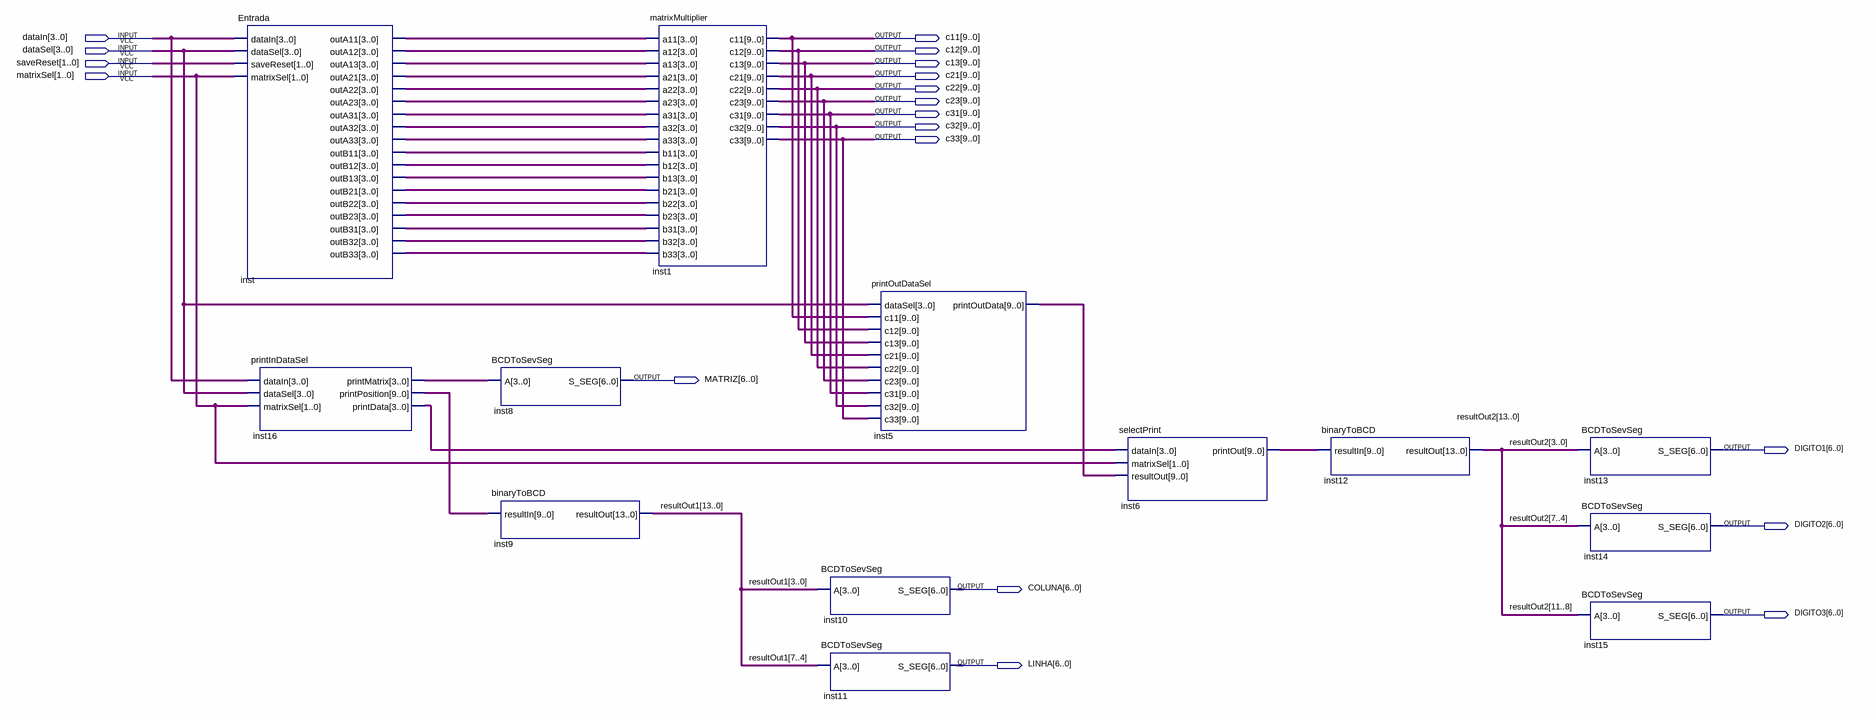
[diagram p0: schematic sheet]
// Quartus schematic Matrix_Multiplier.bdf as structural Verilog: 13 symbols, 19 pins
module Matrix_Multiplier (
  input  [3:0] dataIn,
  input  [3:0] dataSel,
  input  [1:0] saveReset,
  input  [1:0] matrixSel,
  output [9:0] c11,
  output [9:0] c12,
  output [9:0] c13,
  output [9:0] c21,
  output [9:0] c22,
  output [9:0] c23,
  output [9:0] c31,
  output [9:0] c32,
  output [9:0] c33,
  output [6:0] MATRIZ,
  output [6:0] DIGITO1,
  output [6:0] DIGITO2,
  output [6:0] COLUNA,
  output [6:0] DIGITO3,
  output [6:0] LINHA
);

  wire [3:0] inst16_printdata, inst16_printmatrix, inst_outa11, inst_outa12, inst_outa13, inst_outa21,
       inst_outa22, inst_outa23, inst_outa31, inst_outa32, inst_outa33, inst_outb11, inst_outb12,
       inst_outb13, inst_outb21, inst_outb22, inst_outb23, inst_outb31, inst_outb32, inst_outb33;
  wire [9:0] inst5_printoutdata, inst6_printout, inst16_printposition;
  wire [13:0] resultOut1, resultOut2;

  Entrada inst (
    .dataIn(dataIn), .dataSel(dataSel), .saveReset(saveReset), .matrixSel(matrixSel), .outA11(inst_outa11),
    .outA12(inst_outa12), .outA13(inst_outa13), .outA21(inst_outa21), .outA22(inst_outa22),
    .outA23(inst_outa23), .outA31(inst_outa31), .outA32(inst_outa32), .outA33(inst_outa33),
    .outB11(inst_outb11), .outB12(inst_outb12), .outB13(inst_outb13), .outB21(inst_outb21),
    .outB22(inst_outb22), .outB23(inst_outb23), .outB31(inst_outb31), .outB32(inst_outb32),
    .outB33(inst_outb33));
  printInDataSel inst16 (
    .dataIn(dataIn), .dataSel(dataSel), .matrixSel(matrixSel), .printMatrix(inst16_printmatrix),
    .printPosition(inst16_printposition), .printData(inst16_printdata));
  BCDToSevSeg inst8 (.A(inst16_printmatrix), .S_SEG(MATRIZ));
  binaryToBCD inst9 (.resultIn(inst16_printposition), .resultOut(resultOut1));
  matrixMultiplier inst1 (
    .a11(inst_outa11), .a12(inst_outa12), .a13(inst_outa13), .a21(inst_outa21), .a22(inst_outa22),
    .a23(inst_outa23), .a31(inst_outa31), .a32(inst_outa32), .a33(inst_outa33), .b11(inst_outb11),
    .b12(inst_outb12), .b13(inst_outb13), .b21(inst_outb21), .b22(inst_outb22), .b23(inst_outb23),
    .b31(inst_outb31), .b32(inst_outb32), .b33(inst_outb33), .c11(c11), .c12(c12), .c13(c13), .c21(c21),
    .c22(c22), .c23(c23), .c31(c31), .c32(c32), .c33(c33));
  BCDToSevSeg inst10 (.A(resultOut1[3:0]), .S_SEG(COLUNA));
  BCDToSevSeg inst11 (.A(resultOut1[7:4]), .S_SEG(LINHA));
  printOutDataSel inst5 (
    .dataSel(dataSel), .c11(c11), .c12(c12), .c13(c13), .c21(c21), .c22(c22), .c23(c23), .c31(c31),
    .c32(c32), .c33(c33), .printOutData(inst5_printoutdata));
  selectPrint inst6 (
    .dataIn(inst16_printdata), .matrixSel(matrixSel), .resultOut(inst5_printoutdata),
    .printOut(inst6_printout));
  binaryToBCD inst12 (.resultIn(inst6_printout), .resultOut(resultOut2));
  BCDToSevSeg inst13 (.A(resultOut2[3:0]), .S_SEG(DIGITO1));
  BCDToSevSeg inst14 (.A(resultOut2[7:4]), .S_SEG(DIGITO2));
  BCDToSevSeg inst15 (.A(resultOut2[11:8]), .S_SEG(DIGITO3));
endmodule
